# Altium schematic sheet Connections.SchDoc
size A4
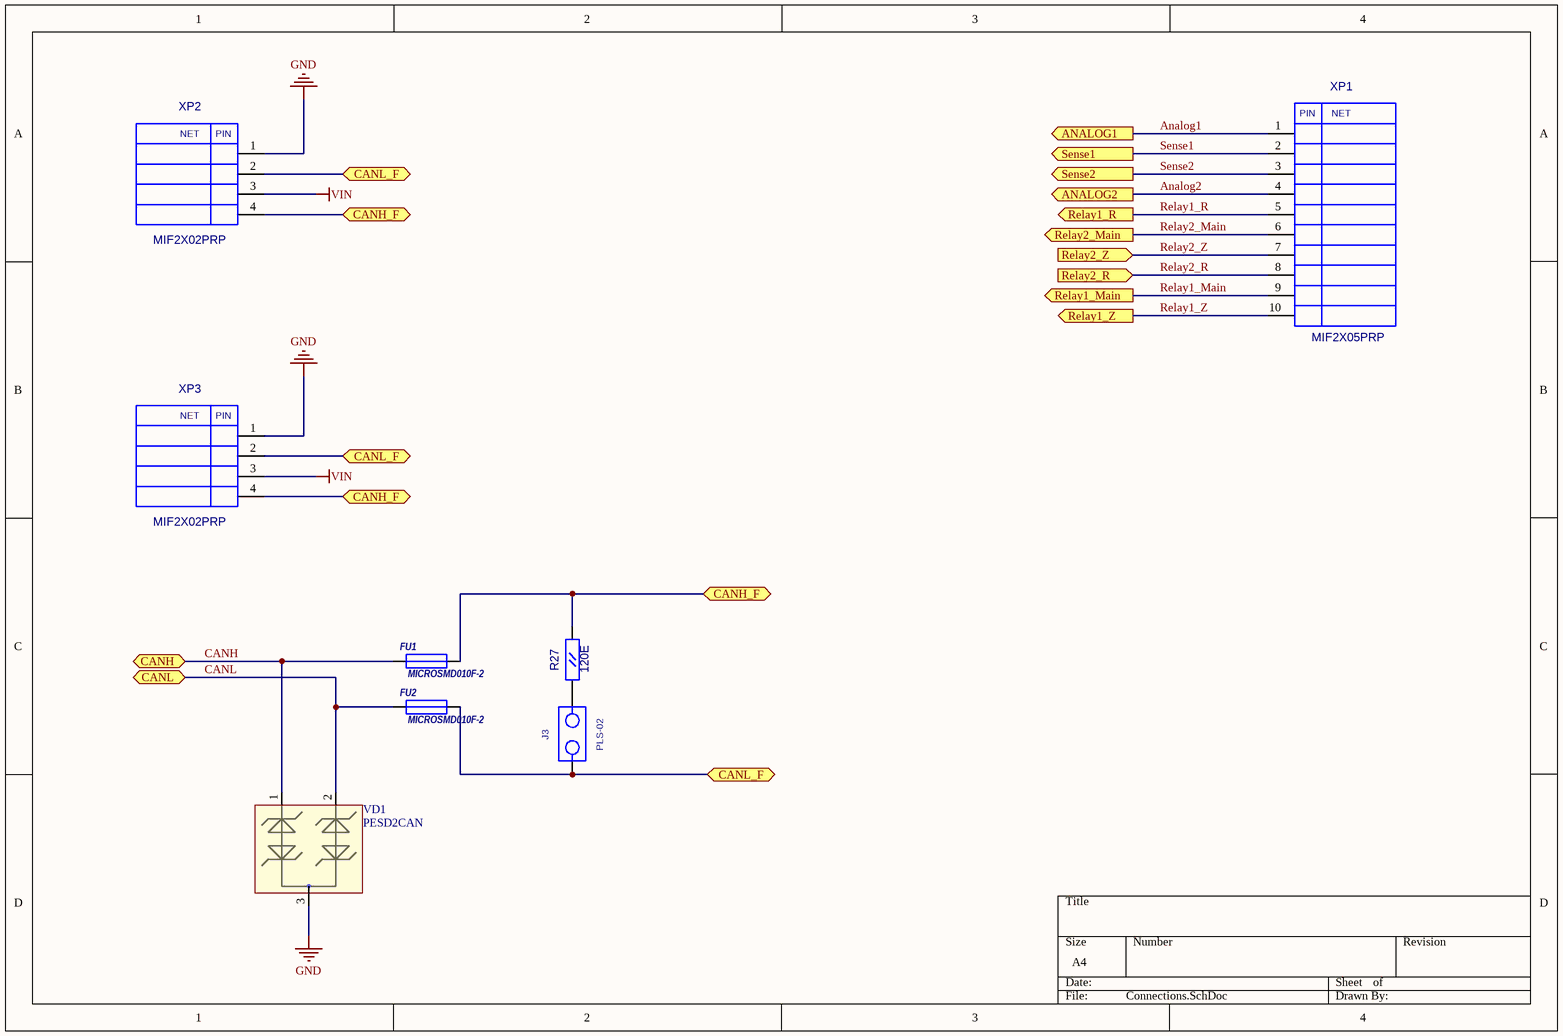
[diagram p0: Connections.SchDoc]

## Parts
FU1  MICROSMD010F-2  [RC1210]
FU2  MICROSMD010F-2  [RC1210]
J3  PLS-02  [PLS-02]
R27  120E  [RC0805]
VD1  PESD2CAN  [SOT-23(123)]
XP1  MIF2X05PRP  [MIF2X05PRP]
XP2  MIF2X02PRP  [MIF2X02PRP]
XP3  MIF2X02PRP  [MIF2X02PRP]

## Ports
ANALOG1 (out), ANALOG2 (out), CANH, CANH_F, CANH_F (bidir), CANL, CANL_F, CANL_F (bidir), Relay1_Main (out), Relay1_R (out), Relay1_Z (out), Relay2_Main (out), Relay2_R (in), Relay2_Z (in), Sense1 (out), Sense2 (out)

## Nets
GND: VD1.3 XP2.1 XP3.1
VIN: XP2.3 XP3.3
Analog1: XP1.1 ; port ANALOG1
Analog2: XP1.4 ; port ANALOG2
CANH: FU1.1 VD1.1 ; port CANH
CANH_F: FU1.2 R27.2(B) XP2.4 XP3.4 ; port CANH_F
CANL: FU2.1 VD1.2 ; port CANL
CANL_F: FU2.2 J3.1 XP2.2 XP3.2 ; port CANL_F
Relay1_Main: XP1.9 ; port Relay1_Main
Relay1_R: XP1.5 ; port Relay1_R
Relay1_Z: XP1.10 ; port Relay1_Z
Relay2_Main: XP1.6 ; port Relay2_Main
Relay2_R: XP1.8 ; port Relay2_R
Relay2_Z: XP1.7 ; port Relay2_Z
Sense1: XP1.2 ; port Sense1
Sense2: XP1.3 ; port Sense2
NetJ3_2: J3.2 R27.1(A)

## Notes on the sheet
- (in symbol MIF2X02PRP) NET; PIN
- (in symbol MIF2X05PRP) PIN; NET

## Library data of the parts
FU1 FU2 = MICROSMD: Value: MICROSMD010F-2
R27 = RC0805: Value: 120E
VD1 = PESD2CAN: TVS for CAN
J3 = PLS-02: Value: *
XP1 = MIF2X05PRP: Value: *
XP2 XP3 = MIF2X02PRP: Value: *